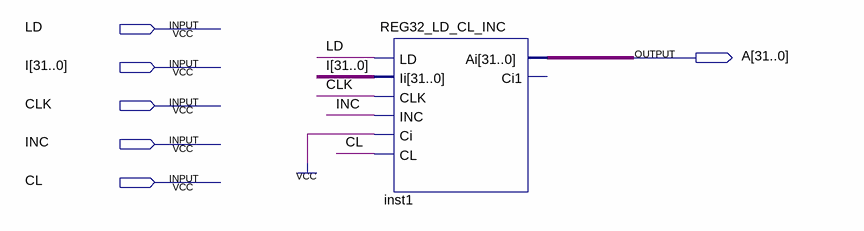
[diagram p0: schematic sheet]
// Quartus schematic MAR.bdf as structural Verilog: 1 symbols, 6 pins
module MAR (
  input  LD,
  input  [31:0] I,
  input  CLK,
  input  INC,
  input  CL,
  output [31:0] A
);

  REG32_LD_CL_INC inst1 (.LD(LD), .Ii(I), .CLK(CLK), .INC(INC), .Ci(1'b1), .CL(CL), .Ai(A));  // open: Ci1
endmodule
